# Altium schematic sheet TitlePage.SchDoc: Title page.
size 297 x 209 mm; Author: Dmitry Shpakov; Organization: NoName; Revision: Revision; SheetNumber: 1; SheetTotal: 9; PageSize: A4; ProjectName: Project Name
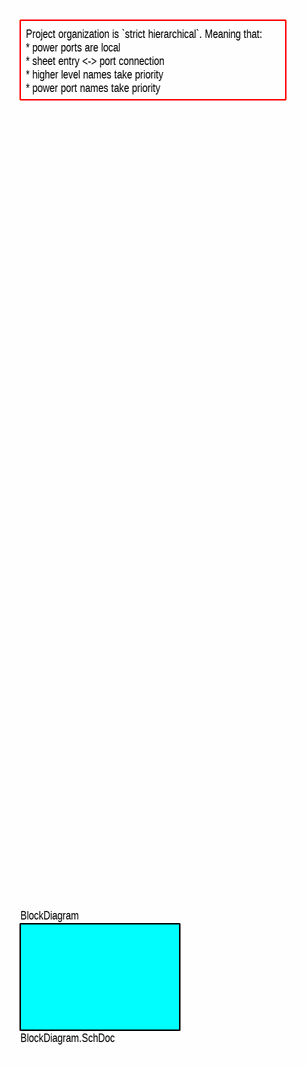
[diagram p0: TitlePage.SchDoc]

## Sub-sheets
BlockDiagram = BlockDiagram.SchDoc: no entries

## Notes on the sheet
- Project organization is `strict hierarchical`. Meaning that:
  * power ports are local
  * sheet entry <-> port connection
  * higher level names take priority
  * power port names take priority
- Author
- Date
- Organization
- Page
- Total pages
- Materials
- Page size